# Altium schematic sheet Sheet1.SchDoc
size A4
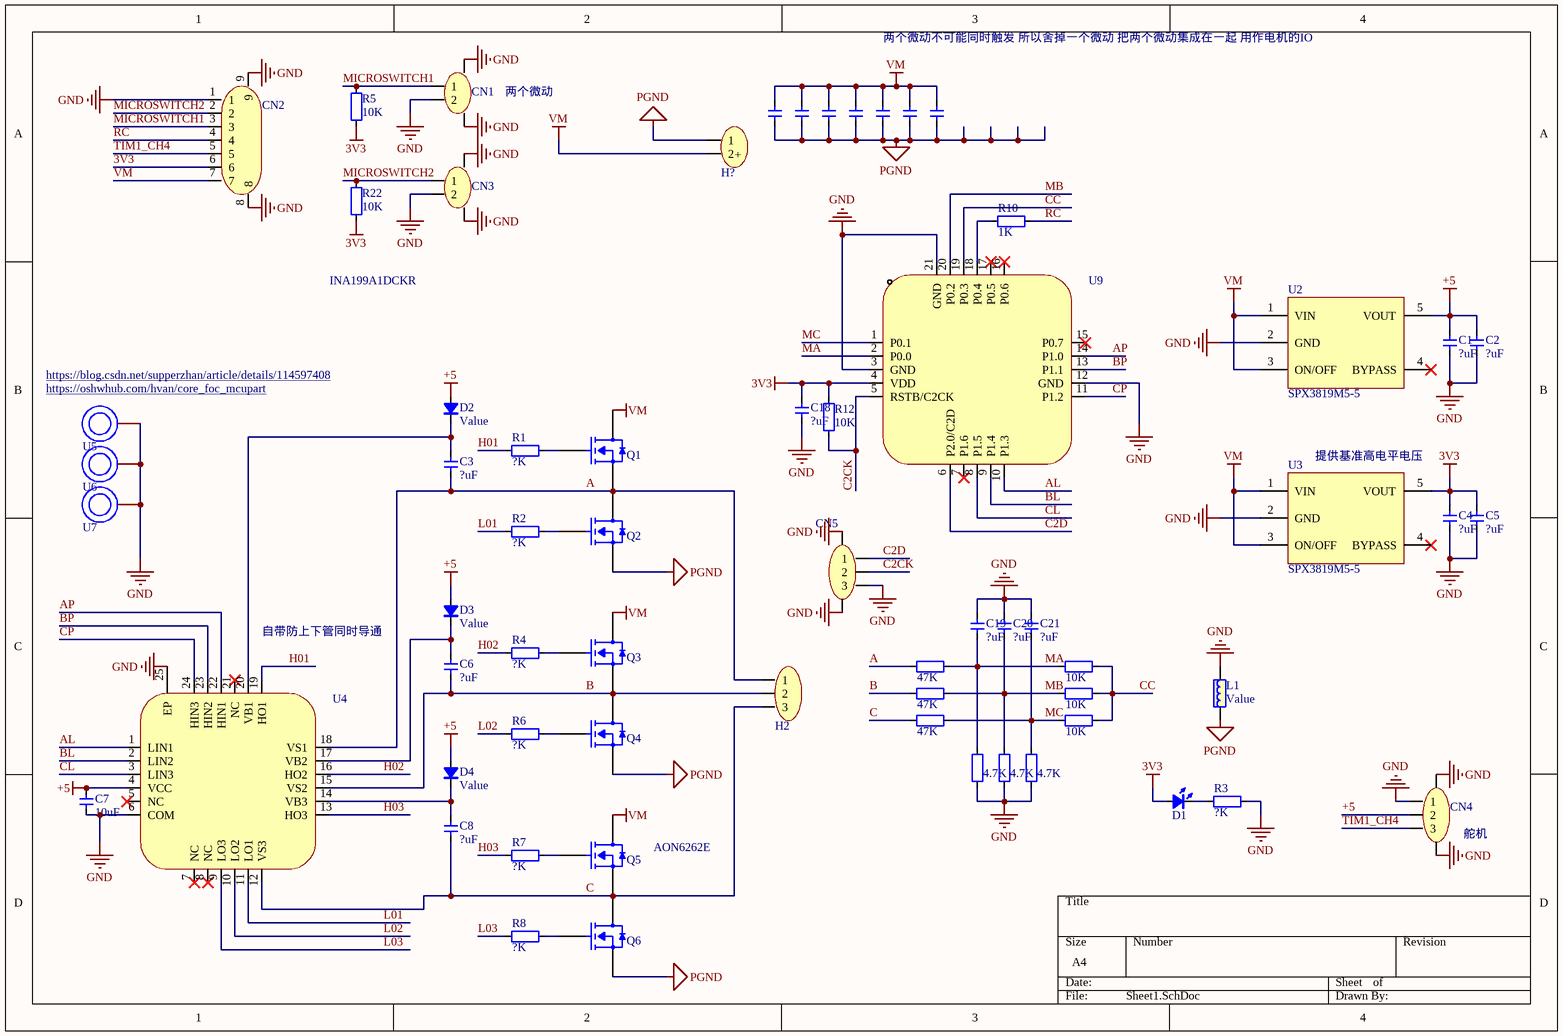
[diagram p0: Sheet1.SchDoc]

## Parts
C1  ?uF  [CAP_0402]
C2  ?uF  [CAP_0402]
C3  ?uF  [CAP_0402]
C4  ?uF  [CAP_0402]
C5  ?uF  [CAP_0402]
C6  ?uF  [CAP_0402]
C7  10uF  [CAP_0402]
C8  ?uF  [CAP_0402]
C9  ?uF  [CAP_1206]  (value not drawn)
C10  ?uF  [CAP_1206]  (value not drawn)
C11  ?uF  [CAP_1206]  (value not drawn)
C12  ?uF  [CAP_1206]  (value not drawn)
C13  ?uF  [CAP_1206]  (value not drawn)
C14  ?uF  [CAP_1206]  (value not drawn)
C18  ?uF  [CAP_0402]
C19  ?uF  [CAP_0402]
C20  ?uF  [CAP_0402]
C21  ?uF  [CAP_0402]
C22  ?uF  [CAP_1206]  (value not drawn)
CN1  HDGC1002WR-S-3P  [SH1.0_2P]  (value not drawn)
CN2  HDGC1002WR-S-7P  [SH1.0_7P]  (value not drawn)
CN3  HDGC1002WR-S-3P  [SH1.0_2P]  (value not drawn)
CN4  HDGC1002WR-S-3P  [SH1.0_3P]  (value not drawn)
CN5  HDGC1002WR-S-3P  [SH1.0_3P]  (value not drawn)
D1  color?  [LED_0402]  (value not drawn)
D2  Value  [SOD_323]
D3  Value  [SOD_323]
D4  Value  [SOD_323]
H2  MR30  [MR30_F]  (value not drawn)
H?  XT30U_M  [XT60双面-小]  (value not drawn)
L1  Value  [IND_0805]
Q1  Value  [SOT23_3]  (value not drawn)
Q2  Value  [SOT23_3]  (value not drawn)
Q3  Value  [SOT23_3]  (value not drawn)
Q4  Value  [SOT23_3]  (value not drawn)
Q5  Value  [SOT23_3]  (value not drawn)
Q6  Value  [SOT23_3]  (value not drawn)
R1  ?K  [RES_0402]
R2  ?K  [RES_0402]
R3  ?K  [RES_0402]
R4  ?K  [RES_0402]
R5  10K  [RES_0402]
R6  ?K  [RES_0402]
R7  ?K  [RES_0402]
R8  ?K  [RES_0402]
R10  1K  [RES_0402]
R12  10K  [RES_0402]
R13  47K  [RES_0402]
R14  10K  [RES_0402]
R15  47K  [RES_0402]
R16  10K  [RES_0402]
R17  47K  [RES_0402]
R18  10K  [RES_0402]
R19  4.7K  [RES_0402]
R20  4.7K  [RES_0402]
R21  4.7K  [RES_0402]
R22  10K  [RES_0402]
U2  SPX3819M5-5  [SOT23_5]
U3  SPX3819M5-5  [SOT23_5]
U4  FD6288Q  [QFN-24_L4.0-W4.0-P0.50-BL-EP2.6]  (value not drawn)
U5  螺柱孔  [M2]  (value not drawn)
U6  螺柱孔  [M2]  (value not drawn)
U7  螺柱孔  [M2]  (value not drawn)
U9  EFM8BB21F16G-C-QFN20R  [QFN-20_L3.0-W3.0-P0.50-BL-EP1.7_EFM8BB21F16G]  (value not drawn)

## Nets
3V3: C4.2 C5.2 C18.2 CN2.6 D1.1(A) R5.1 R12.2 R22.1 U3.5(VOUT) U9.4(VDD)
+5: C1.2 C2.2 C7.2 CN4.2 D2.1(A) D3.1(A) D4.1(A) U2.5(VOUT) U4.4(VCC)
GND: C1.1 C2.1 C4.1 C5.1 C7.1 C18.1 C19.2 C20.2 C21.2 CN1.2 CN1.SH1 CN1.SH2 CN2.1 CN2.8 CN2.9 CN3.2 CN3.SH1 CN3.SH2 CN4.1 CN4.SH1 CN4.SH2 CN5.3 CN5.4 CN5.5 L1.2 R3.2 R19.1 R20.1 R21.1 U2.2(GND) U3.2(GND) U4.6(COM) U4.25(EP) U5.1 U6.1 U7.1 U9.3(GND) U9.12(GND) U9.21(GND)
PGND: C9.1 C10.1 C11.1 C12.1 C13.1 C14.1 C22.1 H?.1 L1.1 Q2.2(S) Q4.2(S) Q6.2(S)
VM: C9.2 C10.2 C11.2 C12.2 C13.2 C14.2 C22.2 CN2.7 H?.2 Q1.3(D) Q3.3(D) Q5.3(D) U2.1(VIN) U2.3(ON/OFF) U3.1(VIN) U3.3(ON/OFF)
A: C3.1 H2.1 Q1.2(S) Q2.3(D) R13.1 U4.18(VS1)
AL: U4.1(LIN1) U9.10(P1.3)
AP: U4.22(HIN1) U9.14(P1.0)
B: C6.1 H2.2 Q3.2(S) Q4.3(D) R15.1 U4.15(VS2)
BL: U4.2(LIN2) U9.9(P1.4)
BP: U4.23(HIN2) U9.13(P1.1)
C: C8.1 H2.3 Q5.2(S) Q6.3(D) R17.1 U4.12(VS3)
C2CK: CN5.2 R12.1 U9.5(RSTB/C2CK)
C2D: CN5.1 U9.6(P2.0/C2D)
CC: R14.2 R16.2 R18.2 U9.19(P0.3)
CL: U4.3(LIN3) U9.8(P1.5)
CP: U4.24(HIN3) U9.11(P1.2)
H01: R1.1 U4.19(HO1)
H02: R4.2 U4.16(HO2)
H03: R7.1 U4.13(HO3)
L01: R2.2 U4.11(LO1)
L02: R6.1 U4.10(LO2)
L03: R8.1 U4.9(LO3)
MA: C19.1 R13.2 R14.1 R19.2 U9.2(P0.0)
MB: C20.1 R15.2 R16.1 R20.2 U9.20(P0.2)
MC: C21.1 R17.2 R18.1 R21.2 U9.1(P0.1)
MICROSWITCH1: CN1.1 CN2.3 R5.2
MICROSWITCH2: CN2.2 CN3.1 R22.2
RC: CN2.4 R10.2
TIM1_CH4: CN2.5 CN4.3
NetC3_2: C3.2 D2.2(K) U4.20(VB1)
NetC6_2: C6.2 D3.2(K) U4.17(VB2)
NetC8_2: C8.2 D4.2(K) U4.14(VB3)
NetD1_2: D1.2(K) R3.1
NetQ1_1: Q1.1(G) R1.2
NetQ2_1: Q2.1(G) R2.1
NetQ3_1: Q3.1(G) R4.1
NetQ4_1: Q4.1(G) R6.2
NetQ5_1: Q5.1(G) R7.2
NetQ6_1: Q6.1(G) R8.2
NetR10_1: R10.1 U9.18(P0.4)

Not connected (* = marked no-connect by the designer): U2 4(BYPASS)*; U3 4(BYPASS)*; U4 5(NC)* 7(NC)* 8(NC)* 21(NC)*; U9 7(P1.6)* 15(P0.7)* 16(P0.6)* 17(P0.5)*

## Notes on the sheet
- 两个微动不可能同时触发 所以舍掉一个微动 把两个微动集成在一起 用作电机的IO
- (near CN1) 两个微动
- INA199A1DCKR
- https://blog.csdn.net/supperzhan/article/details/114597408
- (near U5) https://oshwhub.com/hvan/core_foc_mcupart
- (near U3) 提供基准高电平电压
- 自带防上下管同时导通
- (near Q5) AON6262E
- (near CN4) 舵机
- (in symbol XT30U_M) +

## Library data of the parts
C1-C14 C18-C22 = Capacitor_MLCC
CN1 CN3 = SH1.0-2P: SH1.0针座卧贴 2P; Manufacturer: HDGC(华德共创); Add into BOM: yes; Name: HDGC1002WR-S-3P; Symbol: HDGC1002WR-S-3P; Device: HDGC1002WR-S-3P; LCSC Part Name: SH1.0针座卧贴 3P; Supplier Part: C2936213; Manufacturer Part: HDGC1002WR-S-3P; Supplier Footprint: SMD,P=1mm; JLCPCB Part Class: 扩展库; Datasheet: https://atta.szlcsc.com/upload/public/pdf/source/20211229/E8A09E85670B5E97244D2008A24D97FE.pdf; Supplier: LCSC; Convert to PCB: yes
CN2 = SH1.0-7P: SH1.0针座卧贴 7P; Manufacturer: HDGC(华德共创); Add into BOM: yes; Name: HDGC1002WR-S-7P; Symbol: HDGC1002WR-S-7P; Device: HDGC1002WR-S-7P; LCSC Part Name: SH1.0针座卧贴 7P; Supplier Part: C5175296; Manufacturer Part: HDGC1002WR-S-7P; Supplier Footprint: SMD,P=1mm; JLCPCB Part Class: 扩展库; Datasheet: https://atta.szlcsc.com/upload/public/pdf/source/20220916/BAB1FBE762C51A6AFF93A047416729EC.pdf; Supplier: LCSC; Convert to PCB: yes
CN4 = SH1.0-3P: SH1.0针座卧贴 3P; Manufacturer: HDGC(华德共创); Add into BOM: yes; Name: HDGC1002WR-S-3P; Symbol: HDGC1002WR-S-3P; Device: HDGC1002WR-S-3P; LCSC Part Name: SH1.0针座卧贴 3P; Supplier Part: C2936213; Manufacturer Part: HDGC1002WR-S-3P; Supplier Footprint: SMD,P=1mm; JLCPCB Part Class: 扩展库; Datasheet: https://atta.szlcsc.com/upload/public/pdf/source/20211229/E8A09E85670B5E97244D2008A24D97FE.pdf; Supplier: LCSC; Convert to PCB: yes
CN5 = 3P端子: Manufacturer: HDGC(华德共创); Add into BOM: yes; Name: HDGC1002WR-S-3P; Symbol: HDGC1002WR-S-3P; Device: HDGC1002WR-S-3P; LCSC Part Name: SH1.0针座卧贴 3P; Supplier Part: C2936213; Manufacturer Part: HDGC1002WR-S-3P; Supplier Footprint: SMD,P=1mm; JLCPCB Part Class: 扩展库; Datasheet: https://atta.szlcsc.com/upload/public/pdf/source/20211229/E8A09E85670B5E97244D2008A24D97FE.pdf; Supplier: LCSC; Convert to PCB: yes
D1 = LED: Value: color?
D2-D4 = Diode_SMD: Value: color?
H2 = MR30: Manufacturer: AMASS(艾迈斯); Name: XT30U-M; Symbol: DC电源; Pin Type: IN; Add into BOM: yes; Device: XT30U-M; Convert to PCB: yes; Supplier Part: C99101; Supplier: LCSC; Manufacturer Part: XT30U-M; JLCPCB Part Class: 扩展库
H? = XT30U_M: Manufacturer: AMASS(艾迈斯); Name: XT30U-M; Symbol: DC电源; Pin Type: IN; Add into BOM: yes; Device: XT30U-M; Convert to PCB: yes; Supplier Part: C99101; Supplier: LCSC; Manufacturer Part: XT30U-M; JLCPCB Part Class: 扩展库
L1 = Inductor_SMD
Q1-Q6 = MOSFET_N: N_MOS
R1-R8 R10 R12-R22 = Resistor_SMD: Value: 22R
U2 U3 = LP2992: LP2992_LDO
U4 = FD6288Q: Manufacturer: Fortior Tech(峰岹); Symbol: FD6288Q_C328453; Add into BOM: yes; Name: FD6288Q; Device: FD6288Q; LCSC Part Name: FD6288Q; Supplier Part: C328453; Manufacturer Part: FD6288Q; Supplier Footprint: QFN-24-EP(4x4); JLCPCB Part Class: 扩展库; Datasheet: https://atta.szlcsc.com/upload/public/pdf/source/20181108/C328453_785547738DB9FC0123219FC22539EFAD.pdf; Supplier: LCSC; Convert to PCB: yes
U5-U7 = Hole: Symbol: M2螺柱孔; Add into BOM: yes; _: 3; Device: M2螺柱孔; Convert to PCB: yes
U9 = EFM8BB21F16G-C-QFN20R: CPU内核:51系列;CPU最大主频:50MHz;工作电压范围:2.2V~3.6V;内部振荡器:有;程序 FLASH容量:16K@x8bit;RAM总容量:2.25KB;EEPROM/数据 FLASH容量:-;GPIO端口数量:16;ADC(单元数/通道数/位数):1@x15ch/12bit;外设/功能/协议栈:欠压检测/复位；看门狗；POR；PWM;工作温度范围:-40℃~+85℃;; Manufacturer: SILICON LABS(芯科); Add into BOM: yes; CPU Core: 51系列; Maximum Frequency: 50MHz; Internal Oscillator: 有; RAM Size: 2.25KB; GPIO Ports Number: 16; Name: EFM8BB21F16G-C-QFN20R; Symbol: EFM8BB21F16G-C-QFN20; Device: EFM8BB21F16G-C-QFN20R; LCSC Part Name: 51系列 50MHz 闪存：16K@x8bit RAM：2.25KB; Supplier Part: C80713; Manufacturer Part: EFM8BB21F16G-C-QFN20R; Supplier Footprint: QFN-20; JLCPCB Part Class: 扩展库; Datasheet: https://atta.szlcsc.com/upload/public/pdf/source/20160823/1471947533781.pdf; Supplier: LCSC; Convert to PCB: yes; Supply Voltage Range: 2.2V~3.6V; Program FLASH Size: 16K@x8bit; EEPROM/Data FLASH Size: -; ADC (Units/Channels/bits): 1@x15ch/12bit; Peripherals / Functions / Protocol Stacks: 欠压检测/复位；看门狗；POR；PWM; Operating Temperature Range: -40℃~+85℃